# Altium schematic sheet Thermocouple.SchDoc
size A4; SheetNumber: 4; SheetTotal: 5
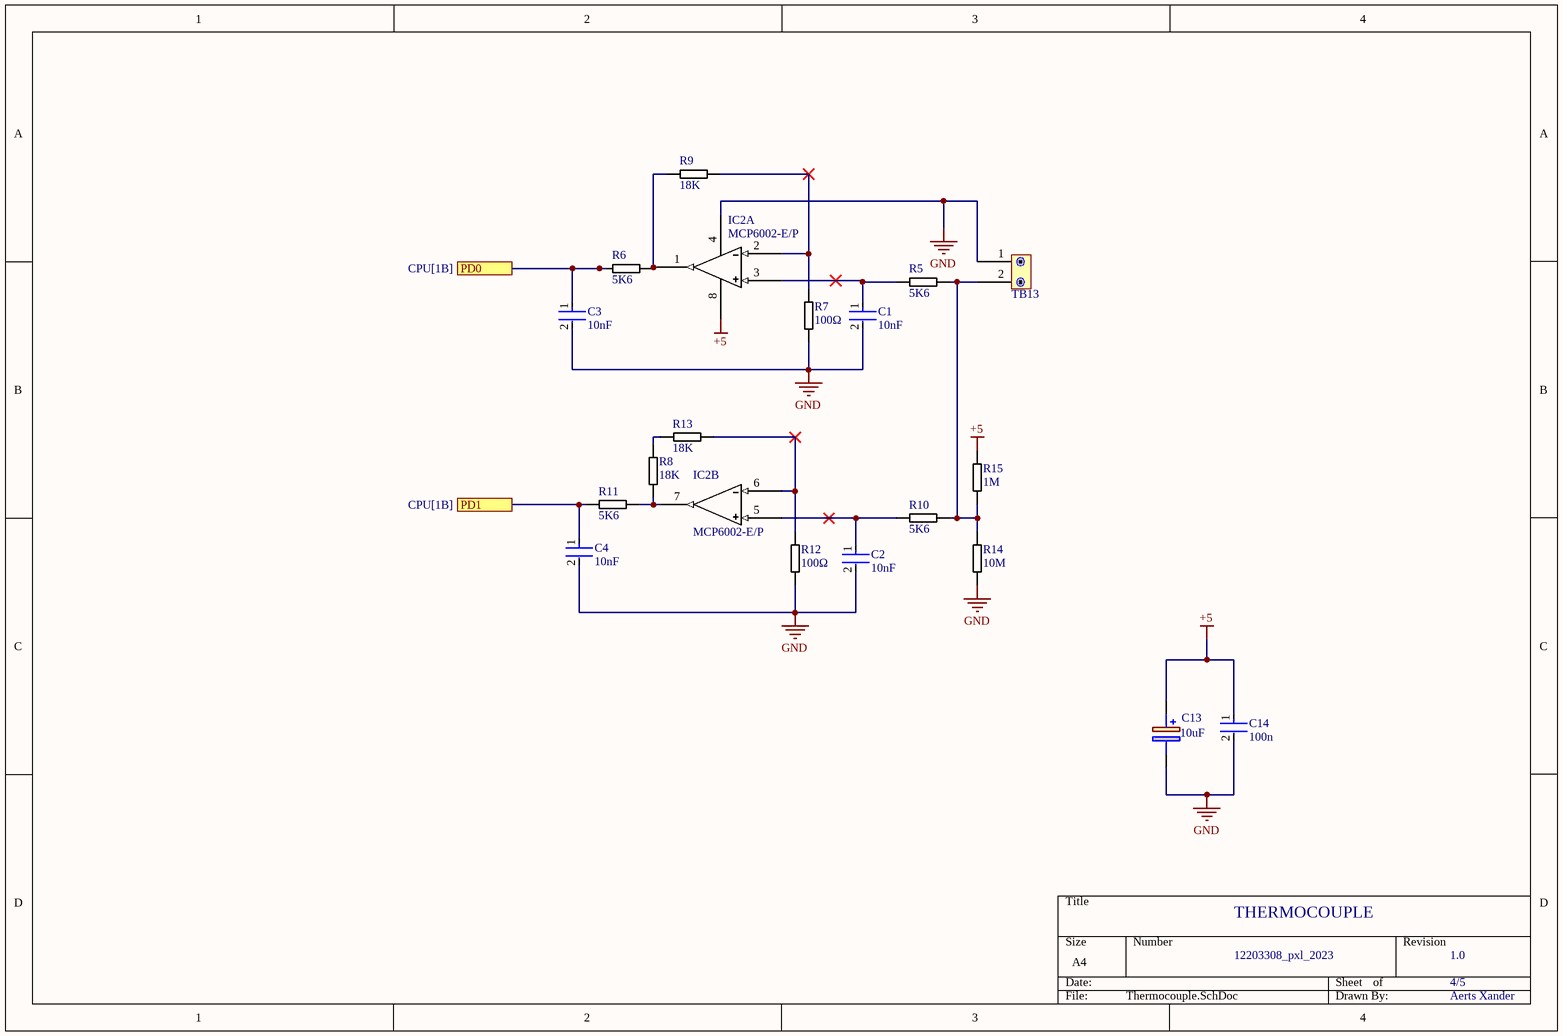
[diagram p0: Thermocouple.SchDoc]

## Parts
C1  10nF  [0805]
C2  10nF  [0805]
C3  10nF  [0805]
C4  10nF  [0805]
C13  10uF  [10uF tht]
C14  100n  [0805]
IC2  MCP6002-E/P  [Dual_Opamp]  (parts A,B of 2)
R5  5K6  [0805]
R6  5K6  [0805]
R7  100Ω  [0805]
R8  18K  [0805]
R9  18K  [0805]
R10  5K6  [0805]
R11  5K6  [0805]
R12  100Ω  [0805]
R13  18K  [0805]
R14  10M  [0805]
R15  1M  [0805]
TB13  2pin screw connector  [2pin screw connector]  (value not drawn)

## Ports
PD0 (see CPU[1B]), PD1 (see CPU[1B])

## Nets
+5: C13.1(+) C14.1 IC2.8(VCC) R15.2
GND: C1.2 C2.2 C3.2 C4.2 C13.2(-) C14.2 IC2.4(GND) R7.1 R12.1 R14.1 TB13.1
PD0: C3.1 R6.1 ; port PD0
PD1: C4.1 R11.1 ; port PD1
NetC1_1: C1.1 IC2.3(VinA+) R5.2
NetC2_1: C2.1 IC2.5(VinB+) R10.1
NetIC2_1: IC2.1(VoutA) R6.2 R9.1
NetIC2_2: IC2.2(VinA-) R7.2 R9.2
NetIC2_6: IC2.6(VinB-) R12.2 R13.2
NetIC2_7: IC2.7(VoutB) R8.1 R11.2
NetR5_1: R5.1 R10.2 R14.2 R15.1 TB13.2
NetR8_2: R8.2 R13.1

## Notes on the sheet
- THERMOCOUPLE
- 12203308_pxl_2023
- 1.0
- 4/5
- Aerts Xander

## Library data of the parts
C1-C4 = Capacitor 0805: CAP CER 10000PF 50V X7R 0603; Manufacturer Part Number: CC0603KRX7R9BB103; Manufacturer: YAGEO; Tolerance: 0.1; Material: Ceramic; Temperature Coefficient: 15%; Mouser Description: Multilayer Ceramic Capacitor, CC Series, 0.01 - F, - 10%, X7R, 50 V, 0603 [1608 Metric]; Digikey Description: CAP CER 10000PF 50V X7R 0603; Height: 0.9mm; Category: Cap; Temperature Characteristic: X7R; Footprint Url: http://www.yageo.com/exep/pages/download/literatures/UPY-C_GEN_24.pdf; Lead Free: Yes; Voltage Rating: 50 V; Temperature: -55°C to +125°C; Device Class L3: Ceramic Capacitors; ComponentLink2Description: Datasheet; Voltage: 50 V; Package: CC0603-DA; Octopart: https://octopart.com/cc0603krx7r9bb103-yageo-192938; Automotive: No; Temperature Range High: +125°C; Temperature Range Low: -55°C; Value: 10 nF; RoHS: TRUE; Device Class L1: Passive Components; ComponentLink2URL: http://www.yageo.com/documents/recent/UPY-GPHC_X7R_6.3V-to-50V_18.pdf; Device Class L2: Capacitors; Capacitance: 10 nF
C13 = 10uF tht
C14 = Capacitor 0805: CAP CER 10000PF 50V X7R 0603; Manufacturer Part Number: CC0603KRX7R9BB103; Manufacturer: YAGEO; Tolerance: 0.1; Material: Ceramic; Temperature Coefficient: 15%; Value: 10 nF; Mouser Description: Multilayer Ceramic Capacitor, CC Series, 0.01 - F, - 10%, X7R, 50 V, 0603 [1608 Metric]; Digikey Description: CAP CER 10000PF 50V X7R 0603; Height: 0.9mm; Category: Cap; Temperature Characteristic: X7R; Footprint Url: http://www.yageo.com/exep/pages/download/literatures/UPY-C_GEN_24.pdf; Lead Free: Yes; Voltage Rating: 50 V; Temperature: -55°C to +125°C; Device Class L3: Ceramic Capacitors; ComponentLink2Description: Datasheet; Voltage: 50 V; Package: CC0603-DA; Octopart: https://octopart.com/cc0603krx7r9bb103-yageo-192938; Automotive: No; Temperature Range High: +125°C; Temperature Range Low: -55°C; RoHS: TRUE; Device Class L1: Passive Components; ComponentLink2URL: http://www.yageo.com/documents/recent/UPY-GPHC_X7R_6.3V-to-50V_18.pdf; Device Class L2: Capacitors; Capacitance: 10 nF
IC2 = Dual_Opamp
R5-R15 = resistor: Manufacturer: Vishay Dale; Part Number: CRCW08050000Z0EA